# EAGLE design nodemcurelay (EAGLE 9.6.2)
CNAME: CYBOTIANS; CREVISION: V-1.0.0; DESIGNER: JOYDIP DUTTA
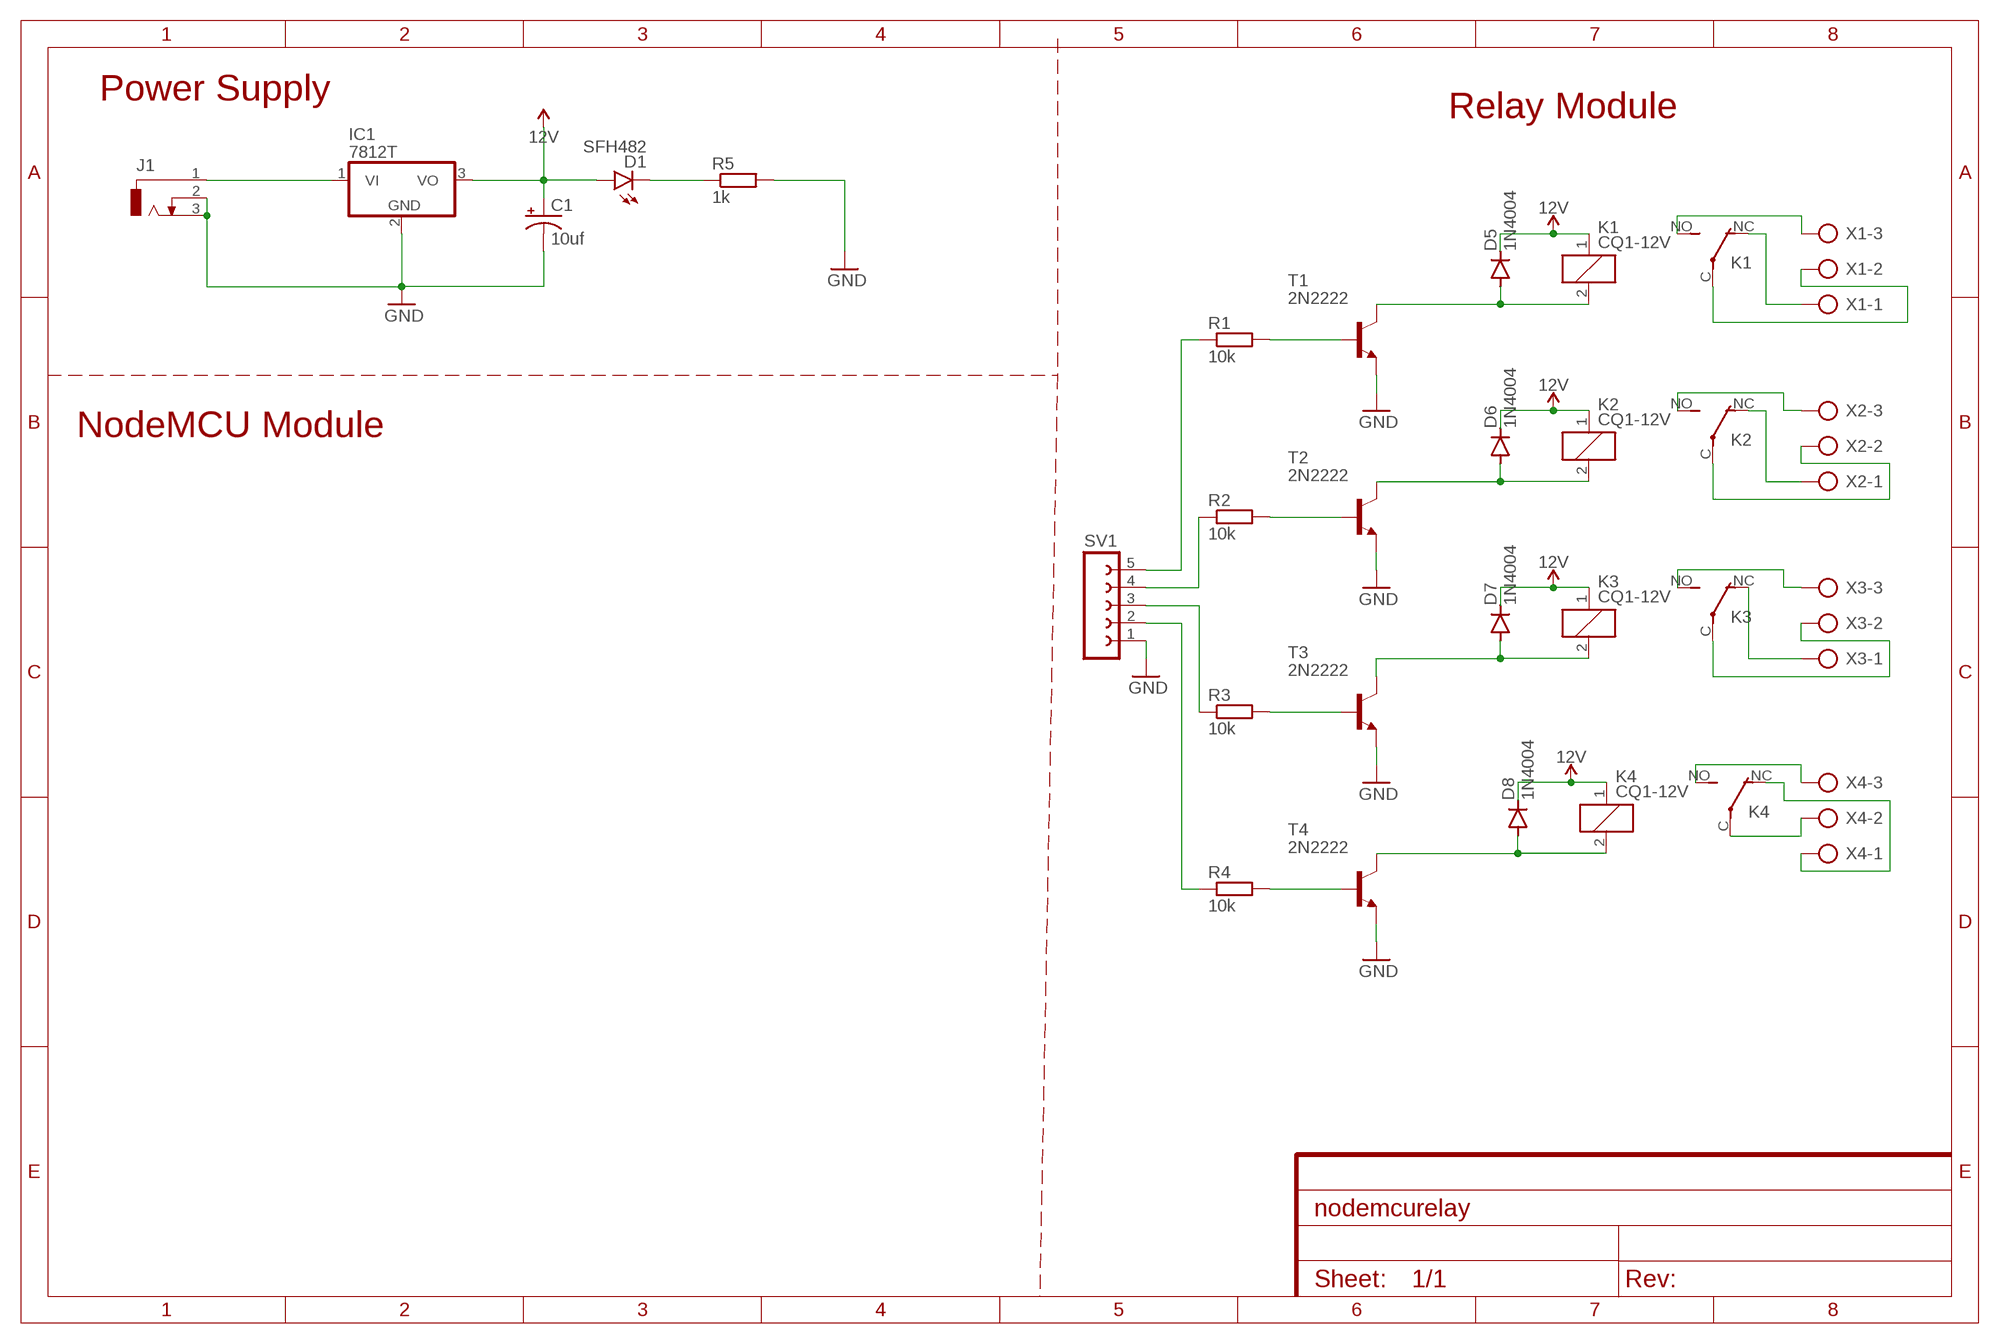
[diagram p0: schematic, sheet 1]

## Parts
C1  10uf  CPOL-USE3.5-8  [E3,5-8]
D1  SFH482  [SFH482]
D5  1N4004  [DO41-10]
D6  1N4004  [DO41-10]
D7  1N4004  [DO41-10]
D8  1N4004  [DO41-10]
IC1  7812T  [TO220H]
J1  DCJ0303  [DCJ0303]
K1  CQ1-12V  [CQ1]
K2  CQ1-12V  [CQ1]
K3  CQ1-12V  [CQ1]
K4  CQ1-12V  [CQ1]
R1  10k  R-EU_0207/7  [0207/7]
R2  10k  R-EU_0207/7  [0207/7]
R3  10k  R-EU_0207/7  [0207/7]
R4  10k  R-EU_0207/7  [0207/7]
R5  1k  R-EU_0207/7  [0207/7]
SV1  FE05-1  [FE05-1]
T1  2N2222  [TO92-EBC-OVAL]
T2  2N2222  [TO92-EBC-OVAL]
T3  2N2222  [TO92-EBC-OVAL]
T4  2N2222  [TO92-EBC-OVAL]
X1  AK300/3  [AK300/3]
X2  AK300/3  [AK300/3]
X3  AK300/3  [AK300/3]
X4  AK300/3  [AK300/3]

## Nets
12V: C1.+ D1.A D5.C D6.C D7.C D8.C IC1.3(VO) K1.1 K2.1 K3.1 K4.1
GND: C1.- IC1.2(GND) J1.2 J1.3 R5.2 SV1.1 T1.E T2.E T3.E T4.E
N$1: R1.2 T1.B
N$2: R2.2 T2.B
N$3: R3.2 T3.B
N$4: R4.2 T4.B
N$5: IC1.1(VI) J1.1
N$6: D5.A K1.2 T1.C
N$7: K1.NO(2:S) X1.3
N$8: D6.A K2.2 T2.C
N$9: D1.K(C) R5.1
N$10: D7.A K3.2 T3.C
N$11: K1.NC(2:O) X1.1
N$12: D8.A K4.2 T4.C
N$13: R1.1 SV1.5
N$14: R2.1 SV1.4
N$15: R3.1 SV1.3
N$16: R4.1 SV1.2
N$17: K1.C(2:P) X1.2
N$18: K2.NC(2:O) X2.1
N$19: K2.C(2:P) X2.2
N$20: K2.NO(2:S) X2.3
N$21: K3.NO(2:S) X3.3
N$22: K3.NC(2:O) X3.1
N$23: K3.C(2:P) X3.2
N$24: K4.NO(2:S) X4.3
N$25: K4.C(2:P) X4.2
N$26: K4.NC(2:O) X4.1

## Notes on the sheet
- Power Supply
- Relay Module
- NodeMCU Module

## Library data of the parts
C1 = rcl:CPOL-US: POLARIZED CAPACITOR, American symbol; SPICEPREFIX: C
D1 = led:SFH482: IR LED infrared emitting diode, Infineon
D5-D8 = diode:1N4004: DIODE general purpose rectifier, 1 A
IC1 = adafruit:78*: Positive VOLTAGE REGULATOR Added bigger pads to the TO-92 package
J1 = con-jack:DCJ0303: DC POWER JACK Source: DCJ0303.pdf; OC_FARNELL: unknown; OC_NEWARK: unknown
K1-K4 = relay:CQ1-12V: AUTOMOTIVE QUIET RELAY NAiS Source: http://www.mew-europe.com/.. en_ds_61208_0000.pdf; OC_FARNELL: unknown; OC_NEWARK: unknown
R1-R5 = rcl:R-EU_: RESISTOR, European symbol; SPICEPREFIX: R
SV1 = con-lsta:FE05-1: FEMALE HEADER; OC_FARNELL: unknown; OC_NEWARK: unknown
T1-T4 = adafruit:2N2222: NPN TRANSISTOR Big oval pads
X1-X4 = con-ptr500:AK300/3: CONNECTOR; OC_FARNELL: unknown; OC_NEWARK: unknown

## Board
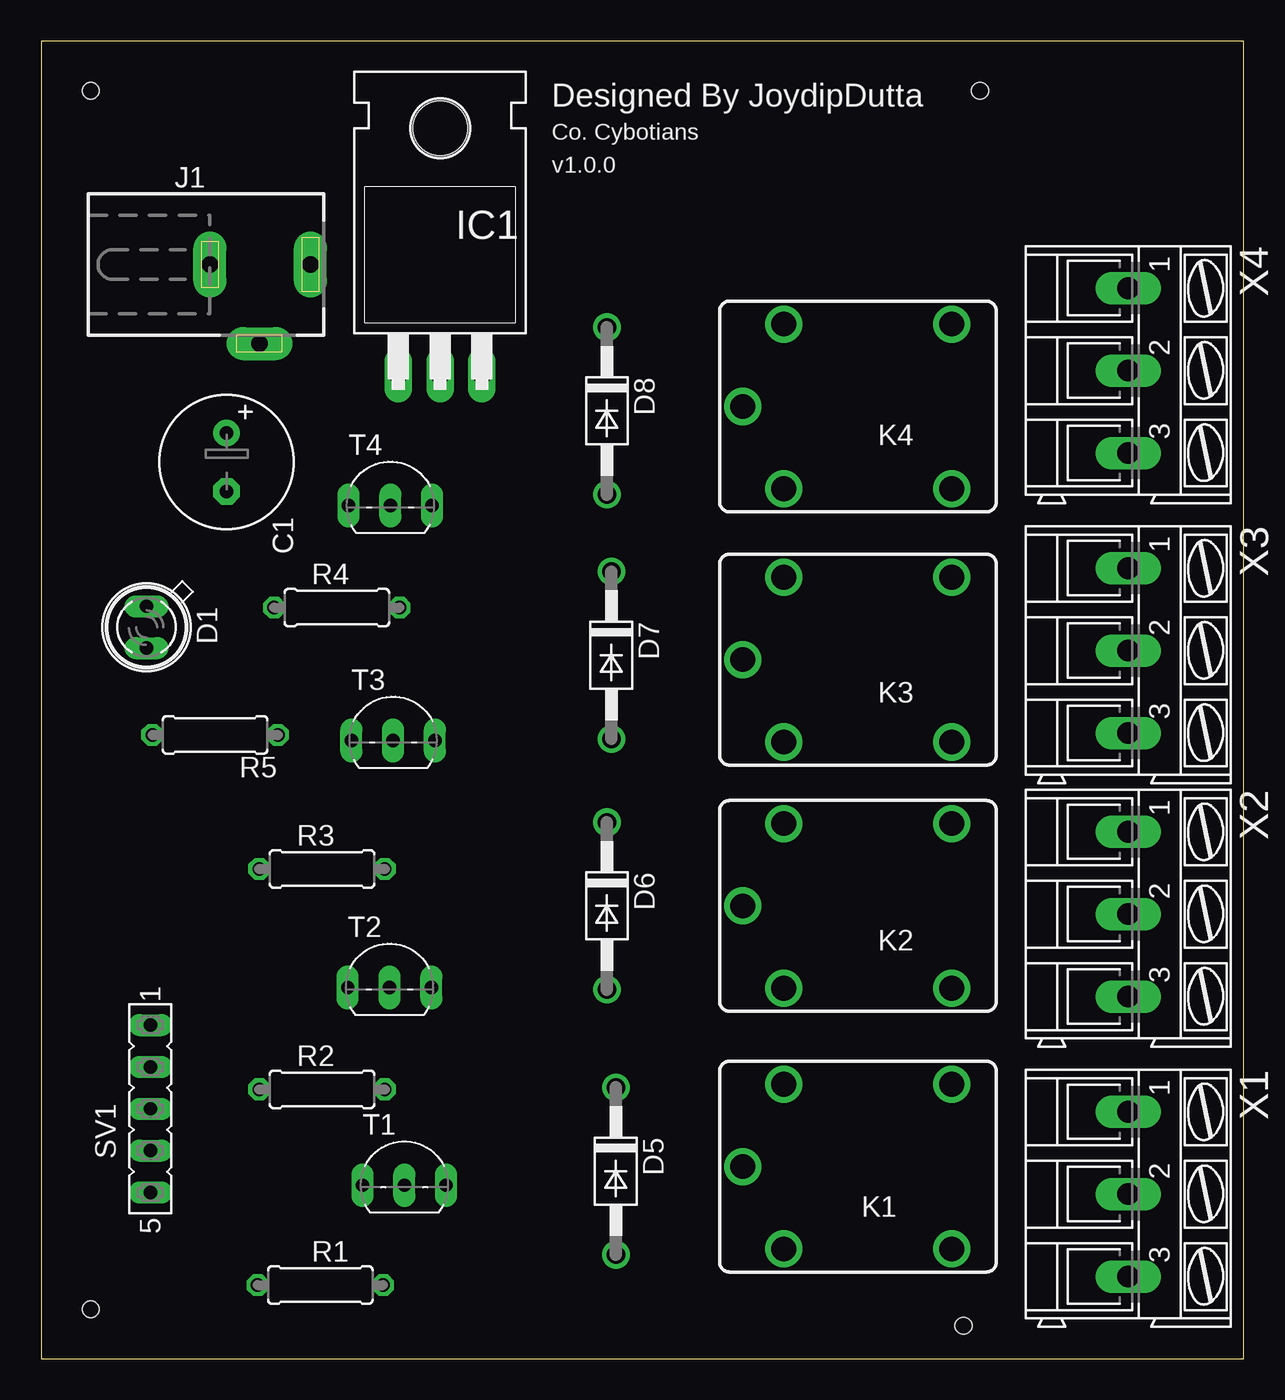
[diagram p1: board, top side]
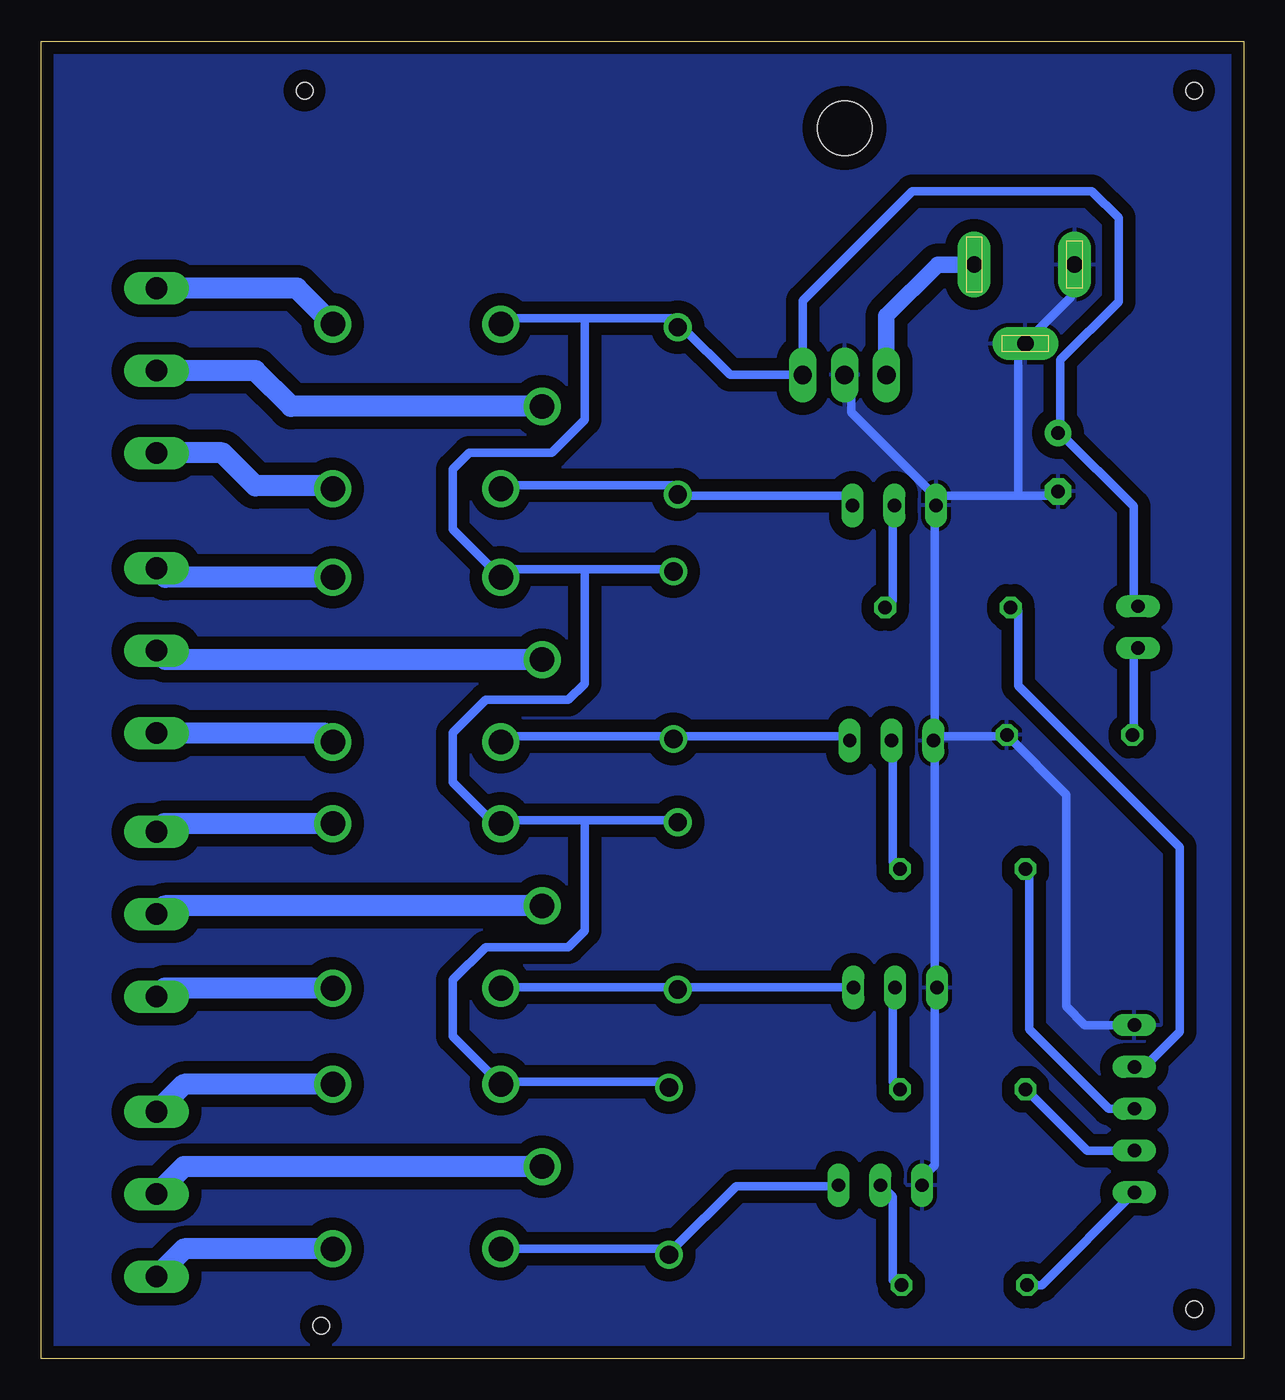
[diagram p2: board, bottom side, seen from below]

Size 73 x 80 mm. Coordinates in mm from the lower left corner, seen from the top.
Outline: 0,0 73,0 73,80 0,80 0,0
Copper layers (1*16): Top 0.035mm / dielectric 1.5mm / Bottom 0.035mm
Design rules "default *": minimum track width 20mil, minimum drill 0.35mm, track to track 30mil, track to pad 6mil, pad to pad 6mil, via to via 6mil, smd to smd 6mil, copper to edge 30mil, drill to drill 6mil, minimum pad ring 10mil, minimum via ring 8mil, stop-mask expansion 4mil, vias tented up to drill 0mil, thermal gap 10mil
Holes 1 mm at 57,77 56,2 3,3 3,77

### Footprints (pad centres in the part's own frame; a part is rotated, then mirrored left to right if it is on the bottom)
E3,5-8 = drill 0.813 pad 1.6: + -1.778,0 | drill 0.813 pad 1.6 octagon: - 1.778,0
SFH482 = drill 0.813 long: A -1.27,0; K 1.27,0
DO41-10 = drill 1.118: A 5.08,0; C -5.08,0
TO220H = drill 1.118 long: 1 -2.54,-10.16; 2 0,-10.16; 3 2.54,-10.16 | hole 3.302: 0,4.826
DCJ0303 = drill 1 pad 2 long: 1 0,3.1; 2 4.8,0; 3 0,-3
CQ1 = drill 1.5: 1 4.5,-5; 2 4.5,5; C 7,0; NC -5.7,-5; NO -5.7,5
0207/7 = drill 0.813 octagon: 1 -3.81,0; 2 3.81,0
FE05-1 = drill 0.813 long: 1 -5.08,0; 2 -2.54,0; 3 0,0; 4 2.54,0; 5 5.08,0
TO92-EBC-OVAL = drill 0.813 long: B 0,-1.27; C 2.54,-1.27; E -2.54,-1.27
AK300/3 = drill 1.321 long: 1 -5.004,0; 2 0,0; 3 5.004,0

### Placement (x,y rotation side)
C1  11.26,54.44 270 top
D1  6.4,44.42 270 top
D5  34.89,11.4 270 top
D6  34.35,27.5 270 top
D7  34.62,42.72 270 top
D8  34.35,57.55 270 top
IC1  24.22,69.9 0 top
J1  13.25,66.44 270 top
K1  49.59,11.67 180 top
K2  49.59,27.5 180 top
K3  49.59,42.45 180 top
K4  49.59,57.82 180 top
R1  16.95,4.48 0 top
R2  17.05,16.36 0 top
R3  17.05,29.74 0 top
R4  17.95,45.61 0 top
R5  10.56,37.88 0 top
SV1  6.63,15.18 270 top
T1  22.05,11.81 0 top
T2  21.15,23.81 0 top
T3  21.37,38.81 0 top
T4  21.2,53.08 0 top
X1  66,10 270 top
X2  66,27 270 top
X3  66,43 270 top
X4  66,60 270 top

### Tracks (layer width: path | path; a pad name or v marks a point on that pad's centre or on a via)
12V
  Bottom 0.508: 40,47.94 44.78,47.94 K3.1 48,50.36 48,54 47,55 42,55 40,57 40,63.19 | 40,47.94 34.62,47.94 D7.C | D5.C 35.25,16.83 44.78,16.83 K1.1 48,19.58 48,23 46,25 41,25 40,26 40,32.7 | 40,32.7 44.78,32.7 K2.1 45.59,33 46,33 48,35 48,38 46,40 41,40 40,41 40,47.94 | 40,32.7 34.62,32.7 D6.C | D1.A 6.68,46.04 6.68,51.75 11.12,56.2 C1.+ 11.12,56.83 11.12,60.64 7.58,64.19 7.58,69.27 9.22,70.9 20.1,70.9 26.76,64.24 IC1.3 31.18,59.74 33.99,62.55 D8.C 34.62,63.19 40,63.19 | 40,63.19 44.78,63.19 K4.1
GND
  Bottom 0.508: J1.3 10.49,66.36 10.49,64.45 13.03,61.92 J1.2 13.67,61.28 13.67,52.39 | 13.67,52.39 11.76,52.39 C1.- | 13.67,52.39 18.11,52.39 T4.E | IC1.2 23.83,59.38 23.83,57.47 18.75,52.39 T4.E | T1.E 19.38,11.11 18.75,11.75 18.75,21.91 T2.E 18.75,22.55 18.75,37.15 T3.E 18.75,37.78 | SV1.1 9.63,20.26 10.78,21.41 10.78,34.26 14.3,37.78 R5.2 14.94,37.78 18.75,37.78 | 18.75,37.78 18.75,51.75 T4.E
  pour Bottom: 0,80 73,80 73,0 0,0
N$1
  Bottom 0.508: R1.2 21.28,4.77 21.28,9.84 21.92,10.48 T1.B
N$2
  Bottom 0.508: R2.2 21.28,16.83 21.28,21.91 T2.B
N$3
  Bottom 0.508: R3.2 21.28,30.16 21.28,37.15 T3.B
N$4
  Bottom 0.508: T4.B 21.28,51.75 21.28,46.04 R4.2
N$5
  Bottom 1.016: J1.1 18.56,66.44 21.68,63.32 IC1.1
N$6
  Bottom 0.508: T1.C 25.09,10.48 30.81,10.48 34.62,6.67 D5.A 35.25,6.67 K1.2
N$7
  Bottom 1.27: K1.NO 64.33,6.67 X1.3
N$8
  Bottom 0.508: T2.C 23.83,22.55 33.99,22.55 D6.A 34.62,22.55 44.78,22.55 K2.2
N$9
  Bottom 0.508: D1.K 6.68,42.87 6.68,38.42 R5.1
N$10
  Bottom 0.508: 34.62,37.78 24.46,37.78 T3.C | 34.62,37.78 44.78,37.78 K3.2 | 34.62,37.78 D7.A
N$11
  Bottom 1.27: K1.NC 64.33,16.67 X1.1
N$12
  Bottom 0.508: T4.C 23.83,52.39 33.99,52.39 D8.A 34.62,53.03 44.78,53.03 K4.2
N$13
  Bottom 0.508: SV1.5 12.25,4.48 R1.1
N$14
  Bottom 0.508: R2.1 13.03,16.2 9.47,12.64 SV1.4
N$15
  Bottom 0.508: SV1.3 8.18,15.18 13,20 13,29.5 R3.1
N$16
  Bottom 0.508: R4.1 13.67,45.41 13.67,40.87 3.87,31.07 3.87,19.86 6.01,17.72 SV1.2
N$17
  Bottom 1.27: K1.C 64.33,11.67 X1.2
N$18
  Bottom 1.27: K2.NC 65.5,32.5 X2.1
N$19
  Bottom 1.27: K2.C 65.5,27.5 X2.2
N$20
  Bottom 1.27: K2.NO 65.5,22.5 X2.3
N$21
  Bottom 1.27: K3.NO 55.84,38 X3.3
N$22
  Bottom 1.27: K3.NC 65.45,47.45 X3.1
N$23
  Bottom 1.27: K3.C 65.45,42.45 X3.2
N$24
  Bottom 1.27: K4.NO 55.47,53 60,53 62,55 X4.3
N$25
  Bottom 1.27: K4.C 57.82,57.82 60,60 X4.2
N$26
  Bottom 1.27: K4.NC 57.47,65 X4.1

### Text on the board
_tsilk: Designed By JoydipDutta | Co. Cybotians | v1.0.0